# EAGLE design WooferAmpIR2153 (EAGLE 6.3)
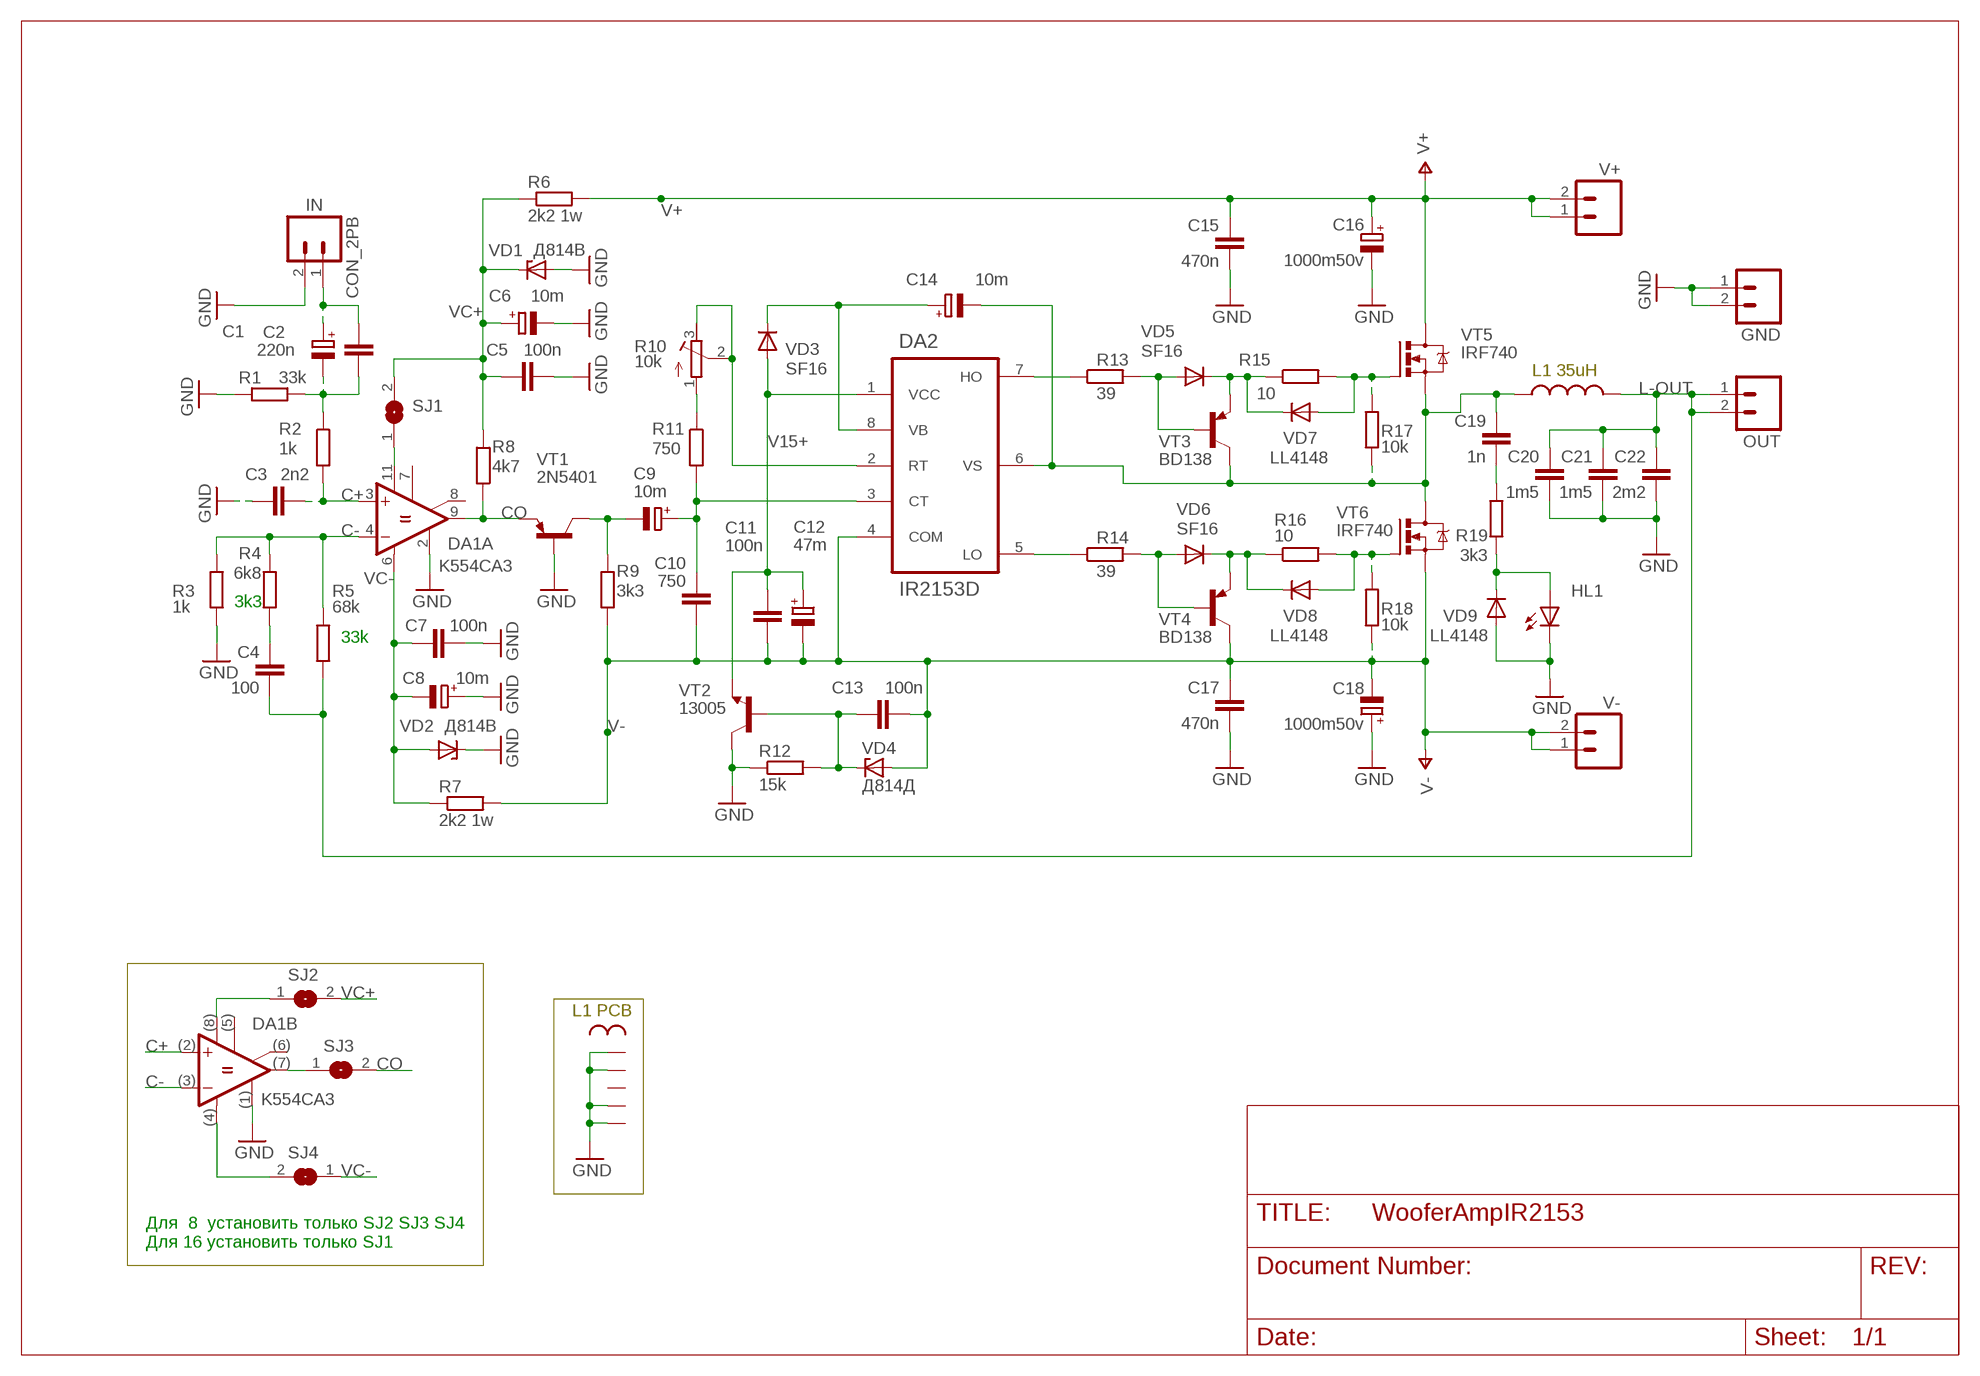
[diagram p0: schematic, sheet 1]

## Parts
C1  CPOL-EUE2.5-6  [E2,5-6]
C2  220n  C-EU050-025X075  [C050-025X075]
C3  2n2  C-EU050-025X075  [C050-025X075]
C4  100  C11X3.5  [C_11X3.5]
C5  100n  C-EU075-032X103  [C075-032X103]
C6  10m  CPOL-EUE2.5-6  [E2,5-6]
C7  100n  C-EU050-025X075  [C050-025X075]
C8  10m  CPOL-EUE2.5-6  [E2,5-6]
C9  10m  CPOL-EUE2.5-6  [E2,5-6]
C10  750  C-EU075-032X103  [C075-032X103]
C11  100n  C-EU050-025X075  [C050-025X075]
C12  47m  CPOL-EUE2.5-6  [E2,5-6]
C13  100n  C-EU050-025X075  [C050-025X075]
C14  10m  CPOL-EUE2.5-6  [E2,5-6]
C15  470n  C-EU150-072X183  [C150-072X183]
C16  1000m50v  CPOL-EUE7.5-18  [E7,5-18]
C17  470n  C-EU150-072X183  [C150-072X183]
C18  1000m50v  CPOL-EUE7.5-18  [E7,5-18]
C19  1n  C-EU050-025X075  [C050-025X075]
C20  1m5  C22X13  [C_22X13]
C21  1m5  C22X13  [C_22X13]
C22  2m2  C23X16  [C_23X16]
DA1  K554CA3  COMPMOD-K554CA3"  [DIL_A(14)]
DA2  IR2153D  [DIL8]
GND  CON_2PA  [CON_PWR_2PIN4MM]
HL1  LED3MM  [LED3MM]
IN  CON_2PB  [CON_PWRI_2PIN4MM]
OUT  CON_2PA  [CON_PWR_2PIN4MM]
R1  33k  R-EU_0207/10  [0207/10]
R2  1k  R-EU_0207/10  [0207/10]
R3  1k  R-EU_M0805  [M0805]
R4  6k8  R-EU_M0805  [M0805]
R5  68k  R-EU_M1206  [M1206]
R6  2k2 1w  R-EU_0613/15  [P0613/15]
R7  2k2 1w  R-EU_0613/15  [P0613/15]
R8  4k7  R-EU_M0805  [M0805]
R9  3k3  R-EU_0207/10  [0207/10]
R10  10k  R-TRIMM3296W  [RTRIM3296W]
R11  750  R-EU_M0805  [M0805]
R12  15k  R-EU_0207/10  [0207/10]
R13  39  R-EU_M1206  [M1206]
R14  39  R-EU_M1206  [M1206]
R15  10  R-EU_M1206  [M1206]
R16  10  R-EU_M1206  [M1206]
R17  10k  R-EU_M1206  [M1206]
R18  10k  R-EU_M1206  [M1206]
R19  3k3  R-EU_M1206  [M1206]
SJ1  SJ  [SJ]
SJ2  SJ  [SJ]
SJ3  SJ  [SJ]
SJ4  SJ  [SJ]
U$1  L-D30  [L-D30]
U$4  PIN  [PIN-L]
U$11  PIN  [PIN-L]
V+  CON_2PA  [CON_PWR_2PIN4MM]
V-  CON_2PA  [CON_PWR_2PIN4MM]
VD1  Д814В  ZDD814  [ZDMETAL]
VD2  Д814В  ZDD814  [ZDMETAL]
VD3  SF16  DIODE-DO204-10  [DO204-10]
VD4  Д814Д  ZDD814  [ZDMETAL]
VD5  SF16  DIODE-DO204-10  [DO204-10]
VD6  SF16  DIODE-DO204-10  [DO204-10]
VD7  LL4148  DIODE-SOD80C  [SOD80C]
VD8  LL4148  DIODE-SOD80C  [SOD80C]
VD9  LL4148  DIODE-SOD80C  [SOD80C]
VT1  2N5401  BJT_PNP_TO-92_EBC  [TO92]
VT2  13005  BJT_NPN_TO220_V_BCE  [TO220FV]
VT3  BD138  BJT_PNP_TO126_V_ECB  [TO126V]
VT4  BD138  BJT_PNP_TO126_V_ECB  [TO126V]
VT5  IRF740  [TO220]
VT6  IRF740  [TO220]

## Nets
C+: C3.2 DA1.3(A:+IN) DA1.(2)(B:+IN) R2.2
C-: DA1.4(A:-IN) DA1.(3)(B:-IN) R3.2 R4.2 R5.2
CO: DA1.9(A:OUT) R8.1 SJ3.2 VT1.1(E)
GATE_A: R15.2 R17.2 VD7.A VT5.1(G)
GND: C3.1 C5.2 C6.- C7.2 C8.+ C15.2 C16.- C17.2 C18.+ C20.2 C21.2 C22.2 DA1.2(A:GND) DA1.(1)(B:GND) GND.1 GND.2 HL1.K(C) IN.2 R1.2 R3.1 R12.1 U$1.1A U$1.1B U$1.2B U$1.D VD1.A VD2.C VD9.A VT1.2(B) VT2.2(C)
L-OUT: C4.2 C20.1 C21.1 C22.1 OUT.1 OUT.2 R5.1 U$11.P$1
N$1: DA2.2(RT) R10.2(S) R10.3(A)
N$2: C13.1 R12.2 VD4.C VT2.1(B)
N$4: C9.+ C10.1 DA2.3(CT) R11.2
N$6: R10.1(E) R11.1
N$7: C4.1 R4.1
N$8: DA1.11(A:V+) SJ1.1
N$9: C19.2 R19.2
N$10: HL1.A R19.1 VD9.C
N$12: DA2.7(HO) R13.1
N$13: DA2.5(LO) R14.1
N$14: R16.1 VD6.C VD8.C VT4.1(E)
N$15: R14.2 VD6.A VT4.3(B)
N$16: R15.1 VD5.C VD7.C VT3.1(E)
N$17: R13.2 VD5.A VT3.3(B)
N$18: R16.2 R18.2 VD8.A VT6.1(G)
N$19: C1.+ C2.1 IN.1
N$28: C1.- C2.2 R1.1 R2.1
N$35: DA1.(7)(B:OUT) SJ3.1
N$37: DA1.(4)(B:V-) SJ4.2
N$40: DA1.(8)(B:V+) SJ2.1
N$50: C9.- R9.1 VT1.3(C)
NL: C14.- C19.1 DA2.6(VS) R17.1 U$4.P$1 VT3.2(C) VT5.3(S) VT6.2(D)
V15+: C11.1 C12.+ DA2.1(VCC) VD3.A VT2.3(E)
V+: C15.1 C16.+ R6.2 V+.1 V+.2 VT5.2(D)
V-: C10.2 C11.2 C12.- C13.2 C17.1 C18.- DA2.4(COM) R7.2 R9.2 R18.1 V-.1 V-.2 VD4.A VT4.2(C) VT6.3(S)
VB: C14.+ DA2.8(VB) VD3.C
VC+: C5.1 C6.+ R6.1 R8.2 SJ1.2 SJ2.2 VD1.C
VC-: C7.1 C8.- DA1.6(A:V-) R7.1 SJ4.1 VD2.A
Unconnected: DA1.7(A:ON) DA1.8(A:ON/STR) DA1.(5)(B:ON) DA1.(6)(B:ON/STR) U$1.2A

## Notes on the sheet
- L1 35uH
- 3k3
- 33k
- L1 PCB
- Для  8  установить только SJ2 SJ3 SJ4
  Для 16 установить только SJ1

## Library data of the parts
C1 C6 C8 C9 C12 C14 C16 C18 = resistor:CPOL-EU: POLARIZED CAPACITOR, European symbol
C2 C3 C5 C7 C10 C11 C13 C15 C17 C19 = resistor:C-EU: CAPACITOR, European symbol
C4 C20-C22 = C:C
DA1 = IC:COMPMOD-K554CA3
DA2 = IC:IR2153
GND IN OUT V+ V- = woofer:CON_2P
HL1 = led:LED: LED OSRAM: - CHIPLED LG R971, LG N971, LY N971, LG Q971, LY Q971, LO R971, LY R971 LH N974, LH R974 LS Q976, LO Q976, LY Q976 LO Q996 - Hyper CHIPLED LW Q18S LB Q993, LB Q99A, LB R99A - SideLED LS A670, LO A670, LY A670, LG A670, LP A670 LB A673, LV A673, LT A673, LW A673 LH A674 LY A675 LS A676, LA A676, LO A676, LY A676, LW A676 LS A679, LY A679, LG A679 - Hyper Micro SIDELED® LS Y876, LA Y876, LO Y876, LY Y876 LT Y87S - SmartLED LW L88C, LW L88S LB L89C, LB L89S, LG L890 LS L89K, LO L89K, LY L89K LS L896, LA L896, LO L896, LY L896 - TOPLED LS T670, LO T670, LY T670, LG T670, LP T670 LSG T670, LSP T670, LSY T670, LOP T670, LYG T670 LG T671, LOG T671, LSG T671 LB T673, LV T673, LT T673, LW T673 LH T674 LS T676, LA T676, LO T676, LY T676, LB T676, LH T676, LSB T676, LW T676 LB T67C, LV T67C, LT T67C, LS T67K, LO T67K, LY T67K, LW E67C LS E67B, LA E67B, LO E67B, LY E67B, LB E67C, LV E67C, LT E67C LW T67C LS T679, LY T679, LG T679 LS T770, LO T770, LY T770, LG T770, LP T770 LB T773, LV T773, LT T773, LW T773 LH T774 LS E675, LA E675, LY E675, LS T675 LS T776, LA T776, LO T776, LY T776, LB T776 LHGB T686 LT T68C, LB T68C - Hyper Mini TOPLED® LB M676 - Mini TOPLED Santana® LG M470 LS M47K, LO M47K, LY M47K Source: http://www.osram.convergy.de LUXEON: - LUMILED® LXK2-PW12-R00, LXK2-PW12-S00, LXK2-PW14-U00, LXK2-PW14-V00 LXK2-PM12-R00, LXK2-PM12-S00, LXK2-PM14-U00 LXK2-PE12-Q00, LXK2-PE12-R00, LXK2-PE12-S00, LXK2-PE14-T00, LXK2-PE14-U00 LXK2-PB12-K00, LXK2-PB12-L00, LXK2-PB12-M00, LXK2-PB14-N00, LXK2-PB14-P00, LXK2-PB14-Q00 LXK2-PR12-L00, LXK2-PR12-M00, LXK2-PR14-Q00, LXK2-PR14-R00 LXK2-PD12-Q00, LXK2-PD12-R00, LXK2-PD12-S00 LXK2-PH12-R00, LXK2-PH12-S00 LXK2-PL12-P00, LXK2-PL12-Q00, LXK2-PL12-R00 Source: www.luxeon.com KINGBRIGHT: KA-3528ASYC Source: www.kingbright.com
R1-R9 R11-R19 = resistor:R-EU_: RESISTOR, European symbol
R10 = resistor:R-TRIMM: Trimm resistor
SJ1-SJ4 = jumper:SJ: SMD solder JUMPER
U$1 = woofer:L-D30
U$4 U$11 = woofer:PIN
VD1 VD2 VD4 = DSS0:ZD
VD3 VD5-VD9 = diode:DIODE-: DIODE
VT1 VT3 VT4 = m_transistor:BJT_PNP: PNP Transistror КТ3107* CBE BD138 ECB
VT2 = m_transistor:BJT_NPN: NPN Transistor 13005 BCE КТ805 ECB КТ3102*М CBE МП37 ТО-5
VT5 VT6 = DSS0:IRF740: N-CHANNEL MOS FET

## Board
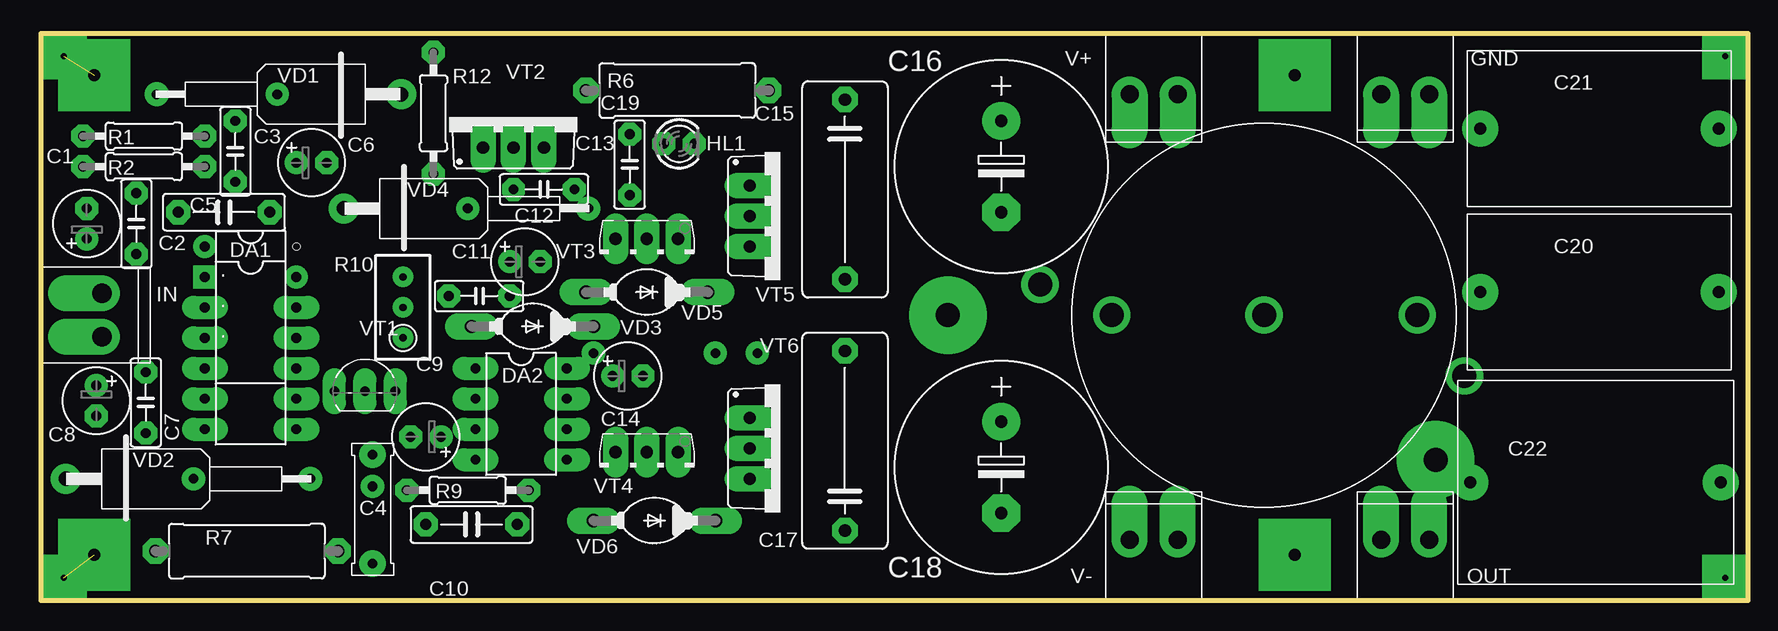
[diagram p1: board, top side]
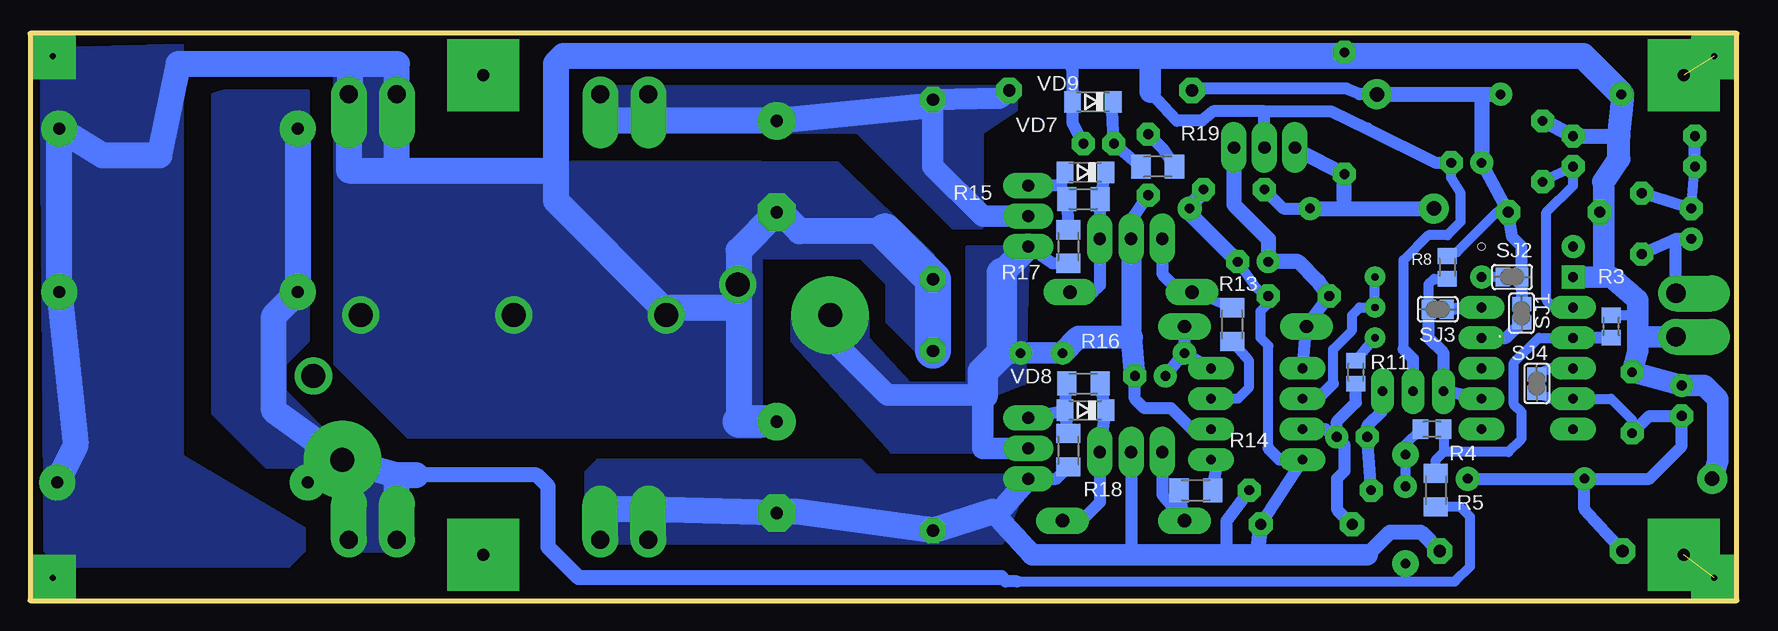
[diagram p2: board, bottom side, seen from below]

Size 142.24 x 47.31 mm. Coordinates in mm from the lower left corner, seen from the top.
Outline: 0,47.31 142.24,47.31 142.24,0 0,0 0,47.31
Copper layers (1*16): Top 0.035mm / dielectric 1.5mm / Bottom 0.035mm
Design rules "DesignRules": minimum track width 8mil, minimum drill 24mil, track to track 0.2mm, track to pad 0.2mm, pad to pad 8mil, via to via 8mil, smd to smd 8mil, copper to edge 10mil, drill to drill 8mil, minimum pad ring 0.55mm, minimum via ring 8mil, stop-mask expansion 4mil, vias tented up to drill 0mil, thermal gap 10mil

### Footprints (pad centres in the part's own frame; a part is rotated, then mirrored left to right if it is on the bottom)
E2,5-6 = drill 0.813 pad 1.6: + -1.27,0 | drill 0.813 pad 1.6 octagon: - 1.27,0
C050-025X075 = drill 0.813 octagon: 1 -2.54,0; 2 2.54,0
C_11X3.5 = drill 0.8 pad 2.2: 1 -4.537,0; 2 4.537,0
C075-032X103 = drill 0.914 octagon: 1 -3.81,0; 2 3.81,0
C150-072X183 = drill 1.016 octagon: 1 -7.493,0; 2 7.493,0
E7,5-18 = drill 1.016 pad 3.15: + -3.81,0 | drill 1.016 pad 3.15 octagon: - 3.81,0
C_22X13 = drill 1 pad 3: 1 -9.938,0; 2 9.938,0
C_23X16 = drill 1 pad 3: 1 -10.438,0; 2 10.438,0
DIL_A(14) = drill 0.813: 1 -3.81,7.62; (8) 3.81,5.08 | drill 0.813 square: 2 -3.81,5.08; (1) -3.81,5.08 | drill 0.813 long: 3 -3.81,2.54; 4 -3.81,0; 6 -3.81,-5.08; 7 -3.81,-7.62; 8 3.81,-7.62; 9 3.81,-5.08; 11 3.81,0; (2) -3.81,2.54; (3) -3.81,0; (4) -3.81,-2.54; (5) 3.81,-2.54; (6) 3.81,0; (7) 3.81,2.54 | hole 0.6: 3.81,7.62
DIL8 = drill 0.813 long: 1 -8.89,-3.81; 2 -6.35,-3.81; 3 -3.81,-3.81; 4 -1.27,-3.81; 5 -1.27,3.81; 6 -3.81,3.81; 7 -6.35,3.81; 8 -8.89,3.81
CON_PWR_2PIN4MM = drill 1.5 pad 3 offset: 1 -2,0; 2 2,0
LED3MM = drill 0.813 octagon: A -1.27,0; K 1.27,0
CON_PWRI_2PIN4MM = drill 1.6 pad 3 offset: 1 -1.81,0; 2 1.81,0
0207/10 = drill 0.813 octagon: 1 -5.08,0; 2 5.08,0
M0805 = smd 1.3 x 1.6: 1 -0.95,0; 2 0.95,0
M1206 = smd 1.6 x 2: 1 -1.4,0; 2 1.4,0
P0613/15 = drill 1.016 octagon: 1 -7.62,0; 2 7.62,0
RTRIM3296W = drill 0.61: 1 0,-2.54; 2 0,0; 3 0,2.54
SJ = smd 1.168 x 1.6: 1 -0.762,0; 2 0.762,0
L-D30 = drill 2: 1A -18.665,2.54; 1B -12.7,0; 2A 16.7,-5.08; 2B 12.76,0; D 0,0
PIN-L = drill 2 pad 6.452: P$1 0,0
ZDMETAL = drill 0.8 pad 2: A 12.27,0 | drill 1.2 pad 2.5: C -8.095,0
DO204-10 = drill 1.118 long: A 5.08,0; C -5.08,0
SOD80C = smd 1.4 x 1.8: A 1.7,0; C -1.7,0
TO92 = drill 0.813 long: 1 -2.54,-1.27; 2 0,-1.27; 3 2.54,-1.27
TO220FV = drill 1.016 long: 1 -2.54,-2.54; 2 0,-2.54; 3 2.54,-2.54
TO126V = drill 1.016 long: 1 -2.603,-1.27; 2 0,-1.27; 3 2.603,-1.27
TO220 = drill 1.016 long: 1 -2.54,-2.54; 2 0,-2.54; 3 2.54,-2.54

### Placement (x,y rotation side)
C1  3.81,31.43 90 top
C2  7.94,31.43 90 top
C3  16.19,37.46 270 top
C4  27.62,7.62 270 top
C5  15.24,32.38 180 top
C6  22.54,36.51 0 top
C7  8.73,16.51 90 top
C8  4.6,16.67 270 top
C9  32.07,13.65 180 top
C10  35.88,6.35 0 top
C11  36.51,25.4 0 top
C12  40.32,28.26 0 top
C13  41.91,34.29 0 top
C14  48.89,18.73 0 top
C15  66.99,34.29 270 top
C16  80.01,36.2 270 top
C17  66.99,13.34 90 top
C18  80.01,11.11 270 top
C19  49.05,36.35 90 top
C20  129.86,25.72 0 top
C21  129.86,39.37 0 top
C22  129.54,9.84 0 top
DA1  17.46,21.91 0 top
DA2  40,10.48 270 top
GND  113.67,42.23 180 top
HL1  53.18,38.1 0 top
IN  5.08,23.81 270 top
OUT  113.67,5.08 0 top
R1  8.57,38.73 0 top
R2  8.57,36.2 0 top
R3  10.48,22.86 270 bottom
R4  25.4,14.29 0 bottom
R5  25.08,9.21 90 bottom
R6  53.02,42.55 0 top
R7  17.15,4.13 0 top
R8  24.13,27.78 90 bottom
R9  35.56,9.21 0 top
R10  30.16,24.45 0 top
R11  31.75,19.05 270 bottom
R12  32.7,40.64 270 top
R13  42.07,23.02 90 bottom
R14  45.09,9.21 180 bottom
R15  54.45,33.5 180 bottom
R16  54.45,18.1 180 bottom
R17  55.72,29.53 90 bottom
R18  55.72,12.54 90 bottom
R19  48.26,36.2 0 bottom
SJ1  17.94,23.97 90 bottom
SJ2  18.73,26.99 0 bottom
SJ3  24.92,24.29 180 bottom
SJ4  16.67,18.1 90 bottom
U$1  101.92,23.81 0 top
U$4  75.57,23.81 0 top
U$11  116.2,11.75 0 top
V+  92.71,42.23 180 top
V-  92.71,5.08 0 top
VD1  21.91,42.23 180 top
VD2  10.16,10.16 0 top
VD3  40.96,22.86 180 top
VD4  33.34,32.7 0 top
VD5  50.48,25.72 180 top
VD6  51.12,6.67 180 top
VD7  54.29,35.72 180 bottom
VD8  54.29,15.88 180 bottom
VD9  53.66,41.59 180 bottom
VT1  26.99,18.73 0 top
VT2  39.37,40.32 0 top
VT3  50.48,28.89 180 top
VT4  50.48,11.11 180 top
VT5  61.59,32.07 270 top
VT6  61.59,12.7 270 top

### Tracks (layer width: path | path; a pad name or v marks a point on that pad's centre or on a via)
C+
  Bottom 0.813: C3.2 R2.2 13.65,34.61 15.88,32.38 15.88,25.08 15.24,24.45 DA1.(2)
C-
  Bottom 0.813: DA1.(3) 16.51,21.91 18.57,19.84 18.57,16.35 17.94,15.72 17.94,13.49 19.05,12.38 24.45,12.38 | R5.2 25.08,11.75 24.45,12.38 | R4.2 24.45,12.38
  Bottom 1.016: R3.2 DA1.(3)
CO
  Bottom 0.813: SJ3.2 25.69,26.38 25.24,26.83 R8.1
  Bottom 1.016: DA1.9 VT1.1 24.45,20.64 25.69,21.88 SJ3.2
GATE_A
  Bottom 1.016: R17.2 R15.2 56.33,34.61 | 56.33,34.61 VT5.1 | 56.33,34.61 VD7.A
GND  (via drill 0.5 pad 3.81)
  Bottom 0.813: C5.2 11.43,33.34 11.11,32.7 | 27.78,20.95 27.78,28.42 25.72,30.48 24.13,30.48 23.02,31.59 23.02,33.97 23.81,35.24 C6.- | R3.1 8.26,23.81 8.26,24.13
  Bottom 1.016: 39.37,40.8 33.81,40.8 30.8,39.37 25.08,36.51 C6.- | VT2.2 39.37,40.8 | 39.37,40.8 43.66,40.8 44.61,40 46.67,40 48.89,42.39 | 52.5,45.29 54.93,45.4 | 55.88,45.4 55.36,44.24 VD9.A 55.36,39.8 HL1.K | VT1.2 26.99,20.16 27.78,20.95
  Bottom 1.27: C3.1 R1.2 9.84,38.74 | R12.1 32.7,45.4
  Bottom 1.778: 9.53,41.8 VD1.A | 48.89,45.4 48.89,42.39 | 11.11,26.99 11.11,32.7 11.11,34.92 | DA1.(1) 11.11,26.99 | VD2.C 1.59,11.59 1.59,16.83 2.7,17.94 C8.+ C7.2 8.26,20.8 8.26,22 | 11.11,26.99 10.48,26.99 8.26,25.08 8.26,24.13 8.26,22 | IN.2 8.26,22
  Bottom 1.93: 11.11,34.92 9.84,36.83 9.84,38.74 9.53,41.8
  Bottom 2.184: VD1.A 12.81,45.4 32.7,45.4 48.89,45.4 54.93,45.4 55.88,45.4 97.79,45.4 98.43,44.77 98.43,35.88 | 83.19,24.45 83.19,29.21 C16.- 79.69,32.38 78.11,30.8 70.99,30.8 | 83.19,24.45 83.19,14.92 | 98.43,35.88 98.43,33.34 89.54,24.45 83.19,24.45 | 111.67,35.88 98.43,35.88 | C22.2 138.43,12.98 C20.2 C21.2 136.21,37.15 131.44,37.15 129.86,44.77 115.57,44.77 | 115.57,44.77 111.67,44.77 GND.2 111.67,35.88 | GND.1 115.67,35.88 111.67,35.88 | 115.57,42.23 115.57,44.77
  Bottom 2.7: 83.19,14.92 C18.+
  Bottom 3: C17.2 C15.2 70.99,30.8
  other vias: 140.33,45.4 140.33,1.9
  pour Bottom (no thermals): 116.84,36.51 116.84,19.68 110.81,13.65 81.28,13.65 81.28,36.51
  pour Bottom (no thermals): 129.54,46.35 129.54,12.06 119.38,6.03 119.38,4.13 120.65,2.86 139.7,2.86 140.97,4.13 141.29,46.04
  pour Bottom (no thermals): 110.81,45.09 110.81,35.88 116.84,35.88 116.84,45.09
  pour Bottom (no thermals): 67.31,19.68 70.8,23.18 70.8,26.35 73.03,28.57 81.28,28.57 81.28,36.51 74.93,36.51 66.99,28.89 66.99,19.68
L-OUT
  Bottom 0.813: 60.01,1.59 27.62,1.59 | 27.62,1.59 23.5,1.59 22.23,2.86 22.23,6.98 23.05,7.81 R5.1 | C4.2 27.62,1.59
  Bottom 1.016: 60.01,1.59 60.96,1.59 61.28,1.91
  Bottom 1.27: 61.28,1.91 96.52,1.91 99.06,4.44 99.06,9.53 100.01,10.48 110.08,10.48
  Bottom 2.184: U$11.P$1 111.67,10.48 | 111.67,10.48 110.08,10.48 | C22.1 U$11.P$1 | C21.1 C20.1 121.92,23.72 121.92,15.87 U$11.P$1 | OUT.1 111.67,10.48 | OUT.2 115.67,11.75 U$11.P$1
  pour Bottom (no thermals): 111.76,4.13 115.57,4.13 115.57,11.11 111.76,11.11
  pour Bottom (no thermals): 119.06,42.55 119.06,21.59 120.97,19.68 120.97,17.46 117.16,13.65 117.16,11.11 122.56,11.11 127,15.56 127,42.23 126.05,42.55
N$1
  Bottom 0.813: 33.66,18.1 33.66,20.95 32.07,22.54 32.07,23.81 31.43,24.45 R10.2 R10.3
  Bottom 1.016: DA2.2 34.92,16.83 33.66,18.1
N$2  (via drill 0.8 pad 1.93)
  Bottom 1.016: C13.1 37.78,32.7 v35.56,32.7
  Bottom 1.27: VT2.1 36.51,37.46 R12.2 32.7,32.7 | v35.56,32.7 32.7,32.7 | 32.7,32.7 VD4.C
N$3  (via drill 1 pad 6)
  other vias: 104.46,43.81
N$4
  Bottom 1.016: C9.+ 34.29,14.29 DA2.3 | C9.+ 33.34,14.92 31.75,16.51 R11.2 | C9.+ 32.7,13.02 32.7,10.79 33.34,10.16 33.34,7.62 C10.1
N$5  (via drill 1 pad 6)
  other vias: 104.46,3.81
N$6
  Bottom 0.813: R11.1 R10.1
N$7  (via drill 0.8 pad 1.93)
  Bottom 0.813: R4.1 27.62,13.02 C4.1 v27.62,9.53
N$8
  Bottom 1.016: DA1.11 19.24,21.91 SJ1.1
N$9
  Bottom 1.016: R19.2 47.81,37.65 C19.2
N$10
  Bottom 1.016: R19.1 HL1.A 52.07,40.85 VD9.C
N$12
  Bottom 0.813: R13.1 40.64,20 40.64,17.78 41.59,16.83 DA2.7
N$13
  Bottom 1.016: R14.1 43.37,10.98 43.18,11.75 DA2.5
N$14
  Bottom 1.016: R16.1 VD8.C VT4.1 53.09,8.19 54.29,6.98 VD6.C
N$15
  Bottom 1.016: R14.2 VD6.A 47.88,8.83 VT4.3
N$16
  Bottom 1.016: VD7.C R15.1 VT3.1 53.09,26.29 53.66,25.72 VD5.C
N$17
  Bottom 0.813: R13.2 VD5.A
  Bottom 1.016: VT3.3 47.88,27.24 46.35,25.72 VD5.A
N$18
  Bottom 1.016: R18.2 VD8.A | VT6.1 VD8.A | VD8.A R16.2
N$19
  Bottom 1.016: C1.+ 5.08,30.16 | 5.08,30.16 C2.1 | IN.1 5.08,30.16
N$26  (via drill 0.5 pad 3.81, 1 pad 6)  (1 unrouted)
  other vias: 4.45,43.81 1.91,45.4
N$28
  Bottom 0.813: C1.- R2.1
  Bottom 1.016: C1.- C2.2 | R2.1 R1.1
N$31  (via drill 0.5 pad 3.81, 1 pad 6)  (1 unrouted)
  other vias: 4.45,3.81 1.91,1.9
N$35
  Bottom 1.016: DA1.(7) SJ3.1
N$37
  Bottom 0.813: DA1.(4) 15.53,19.37 SJ4.2
N$40
  Bottom 0.813: SJ2.1 DA1.(8)
N$50
  Bottom 1.016: C9.- 30.8,13.97 | C9.- 30.8,14.61 29.53,15.87 VT1.3 | R9.1 C9.-
NL  (via drill 0.8 pad 1.93)
  Bottom 1.016: DA2.6 45.4,14.29 47.15,16.03 49.37,16.03 50.16,16.83 C14.- | VT3.2 50.48,31.75 C19.1 | R17.1 57.02,28.13 VT5.3
  Bottom 1.676: VT3.2 50.48,22.22
  Bottom 1.778: U$4.P$1 75.57,21.91 70.8,17.14 62.86,17.14 62.86,12.7 VT6.2 | v56.2,20.64 v59.69,20.64 61.28,20.64 | 50.48,22.22 50.46,21.97 C14.-
  Bottom 1.93: v56.2,20.64 54.87,21.97 50.46,21.97
  Bottom 2.184: VT5.3 61.28,27.31
  Bottom 2.54: 62.86,17.14 62.86,19.05 61.28,20.64 61.28,27.31
  pour Bottom (no thermals): 63.5,18.1 68.9,18.1 72.39,21.91 72.39,23.49 78.74,23.49 78.74,21.59 70.48,12.38 63.5,12.38
  pour Bottom (no thermals): 59.05,29.53 59.37,18.1 64.14,16.19 64.14,29.53
V15+
  Bottom 1.016: DA2.1 VD3.A C11.1
  Bottom 1.27: C11.1 34.92,26.67 36.51,28.26 C12.+ 39.05,30.16 41.91,33.02 VT2.3
V+
  Bottom 1.778: R6.2 61.47,41.91 C15.1 66.99,36.2 62.86,32.07 VT5.2
  Bottom 2.184: C15.1 67.5,41.28 C16.+ 90.71,40 | 90.71,40 94.71,40 V+.1 | V+.2 90.71,40
  pour Bottom (no thermals): 95.25,39.05 73.34,39.05 65.41,31.11 62.86,31.11 62.86,39.05 60.01,40.96 60.01,42.86 95.57,42.86
V-
  Bottom 0.813: C12.- 40,26.04 C11.2 39.05,24.76 39.69,24.13 39.69,21.91 39.05,21.27 39.05,12.7
  Bottom 1.016: C10.2 DA2.4 38.1,11.75 39.05,12.7 | VT4.2 50.48,3.81 | 61.99,7.38 61.67,7.47 | VT6.3 56.7,10.16 R18.1 | R9.2 42.54,6.67 42.54,3.81
  Bottom 1.27: C13.2 VD4.A 45.61,32.27 C12.- | 30.8,3.81 28.89,5.72 26.35,5.72 R7.2 | C10.2 40,3.81
  Bottom 1.778: 30.8,3.81 40,3.81 42.54,3.81 50.48,3.81 58.74,3.81 61.99,7.38 | VT6.3 61.41,7.49 61.67,7.47 62.04,7.43
  Bottom 2.184: 62.04,7.43 C17.1 78.55,7.43 C18.- 90.71,7.62 | 90.71,7.62 94.71,7.62 V-.2 | V-.1 90.71,7.62
  pour Bottom (no thermals): 61.28,4.76 95.89,4.76 95.89,10.79 94.93,11.75 73.03,11.75 71.76,10.48 59.69,10.48 59.69,8.57
VB  (via drill 0.8 pad 1.93)
  Bottom 1.016: VD3.C v46.04,20.64 | DA2.8 v46.04,20.64 | C14.+ v46.04,20.64
VC+  (via drill 0.8 pad 1.93)
  Bottom 0.813: R8.2 23.34,29.05 20,32.38 C5.1
  Bottom 1.016: VD1.C 31.43,42.23 32.54,42.7 44.45,42.7 R6.1 | C6.+ C5.1 18.73,30.32 17.97,29.56 SJ2.2 SJ1.2
  Bottom 1.27: VD1.C 21.27,42.23 | 21.27,42.23 v19.69,42.23 | 21.27,42.23 C6.+
VC-  (via drill 0.8 pad 1.93)
  Bottom 0.813: SJ4.1 15.53,16.83 DA1.6 10.48,16.83 8.73,15.08 C7.1
  Bottom 1.016: VD2.A v12.7,10.16 | v12.7,10.16 7.3,10.16 4.6,12.86 C8.- 7.3,15.4 C7.1 | R7.1 12.7,7.62 v12.7,10.16